# EAGLE design PDB (EAGLE 9.5.0)

## Sheet 1 of 2
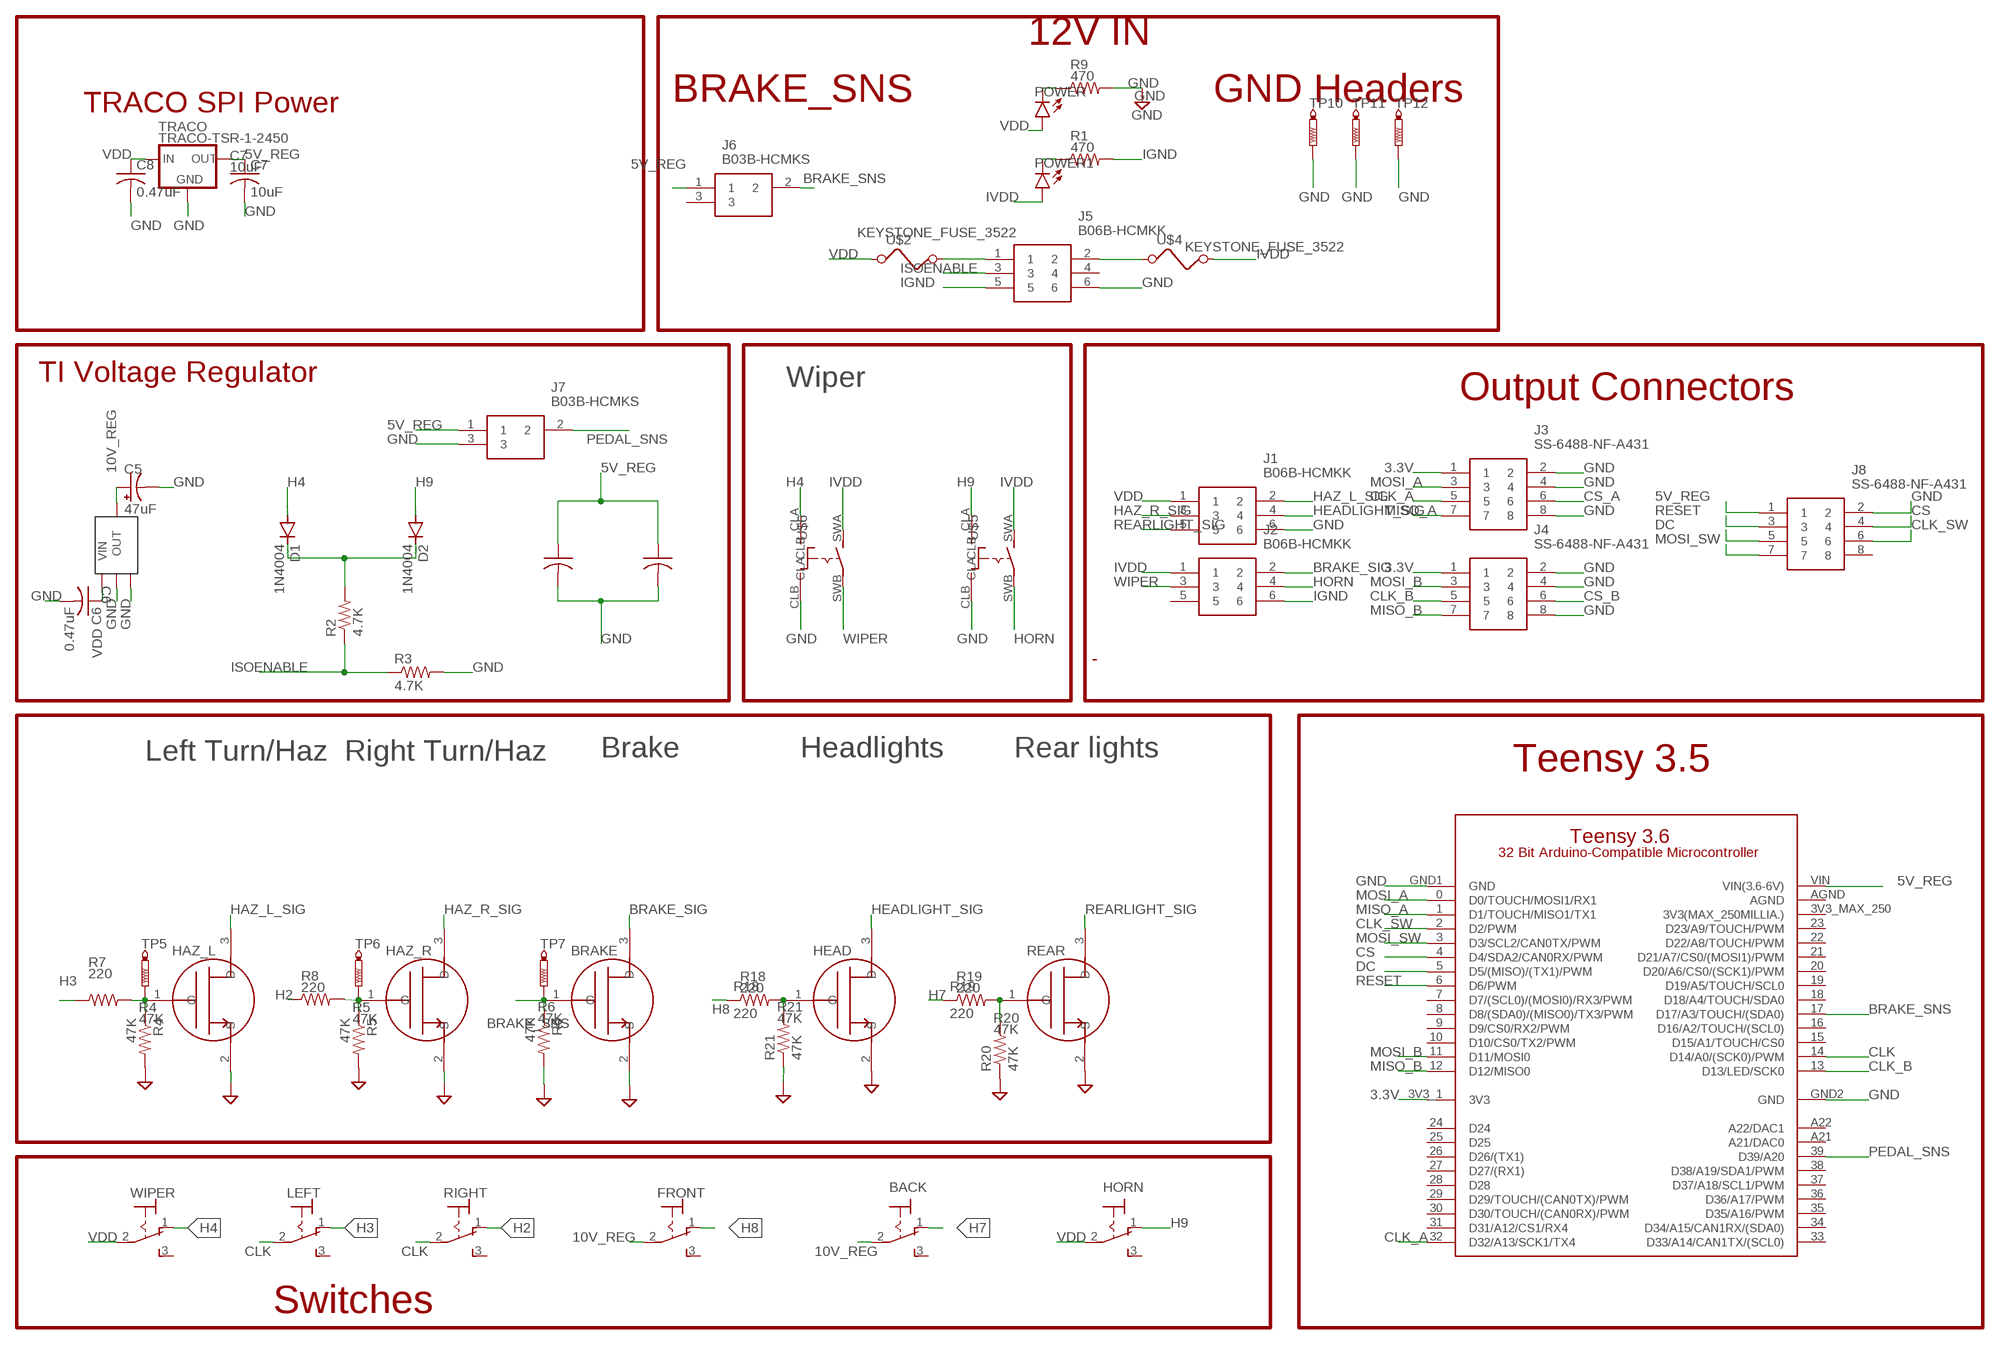
[diagram p0: schematic, sheet 1]

### Parts
BACK  M9040P  [M9040P]
BRAKE  NCV8405ADPAK-3PIN  [TO254P1054X240-3]
C1  0.1uF  C-USC0805  [C0805]
C2  10uF  C-USC0805  [C0805]
C5  47uF  22UF-POLAR-PANASONIC_C-35V-20%  [PANASONIC_C]
C6  0.47uF  C-USC0805  [C0805]
C7  10uF  C-USC0805  [C0805]
C8  0.47uF  C-USC0805  [C0805]
D1  1N4004  [DO41-10]
D2  1N4004  [DO41-10]
FRONT  M9040P  [M9040P]
HAZ_L  NCV8405ADPAK-3PIN  [TO254P1054X240-3]
HAZ_R  NCV8405ADPAK-3PIN  [TO254P1054X240-3]
HEAD  NCV8405ADPAK-3PIN  [TO254P1054X240-3]
HORN  M9040P  [M9040P]
J1  B06B-HCMKK  [B06BHCMKK]
J2  B06B-HCMKK  [B06BHCMKK]
J3  SS-6488-NF-A431  [SS6488NFA431]
J4  SS-6488-NF-A431  [SS6488NFA431]
J5  B06B-HCMKK  [B06BHCMKK]
J6  B03B-HCMKS  [B03BHCMKS]
J7  B03B-HCMKS  [B03BHCMKS]
J8  SS-6488-NF-A431  [SS6488NFA431]
LEFT  M9040P  [M9040P]
LM2940  LM2940LM  [SOT230P700X180-4]
POWER  LEDCHIPLED_0805  [CHIPLED_0805]
POWER1  LEDCHIPLED_0805  [CHIPLED_0805]
R1  470  R-US_R3225  [R3225]
R2  4.7K  R-US_R0805  [R0805]
R3  4.7K  R-US_R0805  [R0805]
R4  47K  R-US_R0805  [R0805]
R5  47K  R-US_R0805  [R0805]
R6  47K  R-US_R0805  [R0805]
R7  220  R-US_R0805  [R0805]
R8  220  R-US_R0805  [R0805]
R9  470  R-US_R3225  [R3225]
R18  220  R-US_R0805  [R0805]
R19  220  R-US_R0805  [R0805]
R20  47K  R-US_R0805  [R0805]
R21  47K  R-US_R0805  [R0805]
REAR  NCV8405ADPAK-3PIN  [TO254P1054X240-3]
RIGHT  M9040P  [M9040P]
TP5  PTR1B2,54  [B2,54]
TP6  PTR1B2,54  [B2,54]
TP7  PTR1B2,54  [B2,54]
TP10  PTR1PAD1-13Y  [P1-13Y]
TP11  PTR1PAD1-13Y  [P1-13Y]
TP12  PTR1PAD1-13Y  [P1-13Y]
TRACO  TRACO-TSR-1-2450  [SIP3]
U$2  KEYSTONE_FUSE_3522  [KEYSTONE_FUSE_3522]
U$3  TEENSY-3.6_ONLY_HOLES  [TEENSY-3.6_ONLY_HOLES]
U$4  KEYSTONE_FUSE_3522  [KEYSTONE_FUSE_3522]
U$5  TE_CON_OJE-SH-112DM,095\  [TE_CON_OJE-SH-112DM,095]
U$6  TE_CON_OJE-SH-112DM,095\  [TE_CON_OJE-SH-112DM,095]
WIPER  M9040P  [M9040P]

### Nets
3.3V: J3.1 J4.1 U$3.3V3_1(3V3)
5V_REG: C1.1 C2.1 C7.1 J6.1 J7.1 J8.1 TRACO.3(OUT) U$3.VIN(VIN(3.6-6V))
10V_REG: BACK.2(P) C5.+ FRONT.2(P) LM2940.3(OUT)
BRAKE_SIG: BRAKE.3(D) J2.2
BRAKE_SNS: BRAKE.1(G) J6.2 R6.1 TP7.TP U$3.17(D17/A3/TOUCH/(SDA0))
CLK: LEFT.2(P) RIGHT.2(P) U$3.14(D14/A0/(SCK0)/PWM)
CLK_A: J3.5 U$3.32(D32/A13/SCK1/TX4)
CLK_B: J4.5 U$3.13(D13/LED/SCK0)
CLK_SW: J8.6 U$3.2(D2/PWM)
CS: J8.4 U$3.4(D4/SDA2/CAN0RX/PWM)
CS_A: J3.6
CS_B: J4.6
DC: J8.5 U$3.5(D5/(MISO)/(TX1)/PWM)
GND: BRAKE.2(S) C1.2 C2.2 C5.- C6.2 C7.2 C8.2 HAZ_L.2(S) HAZ_R.2(S) HEAD.2(S) J1.6 J3.2 J3.4 J3.8 J4.2 J4.4 J4.8 J5.6 J7.3 J8.2 LM2940.2(GND2) LM2940.4(GND) R3.2 R4.2 R5.2 R6.2 R9.2 R20.1 R21.1 REAR.2(S) TP10.TP TP11.TP TP12.TP TRACO.2(GND) U$3.GND1(GND) U$3.GND2(GND) U$5.CLB U$6.CLB
H2: R8.1 RIGHT.1(O)
H3: LEFT.1(O) R7.1
H4: D1.A U$6.CLA WIPER.1(O)
H7: BACK.1(O) R19.1
H8: FRONT.1(O) R18.1
H9: D2.A HORN.1(O) U$5.CLA
HAZ_L_SIG: HAZ_L.3(D) J1.2
HAZ_R_SIG: HAZ_R.3(D) J1.3
HEADLIGHT_SIG: HEAD.3(D) J1.4
HL_GATE: HAZ_L.1(G) R4.1 R7.2 TP5.TP
HORN: J2.4 U$5.SWB
HR_GATE: HAZ_R.1(G) R5.1 R8.2 TP6.TP
IGND: J2.6 J5.5 R1.2
ISOENABLE: J5.3 R2.1 R3.1
IVDD: J2.1 POWER1.A U$4.B1 U$4.B2 U$5.SWA U$6.SWA
MISO_A: J3.7 U$3.1(D1/TOUCH/MISO1/TX1)
MISO_B: J4.7 U$3.12(D12/MISO0)
MOSI_A: J3.3 U$3.0(D0/TOUCH/MOSI1/RX1)
MOSI_B: J4.3 U$3.11(D11/MOSI0)
MOSI_SW: J8.7 U$3.3(D3/SCL2/CAN0TX/PWM)
N$1: POWER.C R9.1
N$3: D1.C D2.C R2.2
N$7: J5.1 U$2.B1 U$2.B2
N$8: J5.2 U$4.A1 U$4.A2
N$10: POWER1.C R1.1
N$14: HEAD.1(G) R18.2 R21.2
N$15: R19.2 R20.2 REAR.1(G)
PEDAL_SNS: J7.2 U$3.39(D39/A20)
REARLIGHT_SIG: J1.5 REAR.3(D)
RESET: J8.3 U$3.6(D6/PWM)
VDD: C6.1 C8.1 HORN.2(P) J1.1 LM2940.1(VIN) POWER.A TRACO.1(IN) U$2.A1 U$2.A2 WIPER.2(P)
WIPER: J2.3 U$6.SWB
Unconnected: BACK.3(S) FRONT.3(S) HORN.3(S) J2.5 J5.4 J6.3 J8.8 LEFT.3(S) RIGHT.3(S) U$3.3V3_MAX_250(3V3(MAX_250MILLIA.)) U$3.7(D7/(SCL0)/(MOSI0)/RX3/PWM) U$3.8(D8/(SDA0)/(MISO0)/TX3/PWM) U$3.9(D9/CS0/RX2/PWM) U$3.10(D10/CS0/TX2/PWM) U$3.15(D15/A1/TOUCH/CS0) U$3.16(D16/A2/TOUCH/(SCL0)) U$3.18(D18/A4/TOUCH/SDA0) U$3.19(D19/A5/TOUCH/SCL0) U$3.20(D20/A6/CS0/(SCK1)/PWM) U$3.21(D21/A7/CS0/(MOSI1)/PWM) U$3.22(D22/A8/TOUCH/PWM) U$3.23(D23/A9/TOUCH/PWM) U$3.24(D24) U$3.25(D25) U$3.26(D26/(TX1)) U$3.27(D27/(RX1)) U$3.28(D28) U$3.29(D29/TOUCH/(CAN0TX)/PWM) U$3.30(D30/TOUCH/(CAN0RX)/PWM) U$3.31(D31/A12/CS1/RX4) U$3.33(D33/A14/CAN1TX/(SCL0)) U$3.34(D34/A15/CAN1RX/(SDA0)) U$3.35(D35/A16/PWM) U$3.36(D36/A17/PWM) U$3.37(D37/A18/SCL1/PWM) U$3.38(D38/A19/SDA1/PWM) U$3.A21(A21/DAC0) U$3.A22(A22/DAC1) WIPER.3(S)

### Notes on the sheet
- 12V IN
- BRAKE_SNS | GND Headers
- TRACO SPI Power
- TI Voltage Regulator | Wiper
- Output Connectors
- Left Turn/Haz | Right Turn/Haz | Brake | Headlights | Rear lights
- Teensy 3.5
- Switches

## Sheet 2 of 2

## Power pins joined to a net without a drawn wire
AGND: U$3.AGND

## Library data of the parts
BACK FRONT HORN LEFT RIGHT WIPER = switch:M9040P: TOGGLE SWITCH Marquardt
BRAKE HAZ_L HAZ_R HEAD REAR = master_library:NCV8405A
C1 C2 C6-C8 = rcl:C-US: CAPACITOR, American symbol; SPICEPREFIX: C
C5 = SparkFun-Capacitors:22UF-POLAR: 22µF polarized capacitors A capacitor is a passive two-terminal electrical component used to store electrical energy temporarily in an electric field.; PROD_ID: CAP-08618; VALUE: 22uF
D1 D2 = diode:1N4004: DIODE general purpose rectifier, 1 A
J1 J2 J5 = AUX Lib:B06B-HCMKK: Automotive Connectors 6P AIT Header Top Position (BLK) Source: Datasheet <https://componentsearchengine.com/Datasheets/1/B06B-HCMKK.pdf>; DESCRIPTION: Automotive Connectors 6P AIT Header Top Position (BLK); HEIGHT: 13.7mm; MANUFACTURER_NAME: JST (JAPAN SOLDERLESS TERMINALS); MANUFACTURER_PART_NUMBER: B06B-HCMKK; MOUSER_PART_NUMBER: 306-B06B-HCMKK; MOUSER_PRICE-STOCK: https://www.mouser.com/Search/Refine.aspx?Keyword=306-B06B-HCMKK
J3 J4 J8 = AUX Lib:SS-6488-NF-A431: Modular Connectors / Ethernet Connectors RJ45 Connector Source: Datasheet <https://www.mouser.pr/datasheet/2/643/dr-STW-SS-6488-NF-A431-1155183.pdf>; DESCRIPTION: Modular Connectors / Ethernet Connectors RJ45 Connector; HEIGHT: 12.82mm; MANUFACTURER_NAME: Bel; MANUFACTURER_PART_NUMBER: SS-6488-NF-A431; MOUSER_PART_NUMBER: 530-SS-6488-NF-A431
J6 J7 = AUX Lib:B03B-HCMKS: Automotive Connectors 3P AIT Header Top Position (Natural) Source: Datasheet <https://componentsearchengine.com/Datasheets/1/B03B-HCMKS.pdf>; DESCRIPTION: Automotive Connectors 3P AIT Header Top Position (Natural); HEIGHT: 13.7mm; MANUFACTURER_NAME: JST (JAPAN SOLDERLESS TERMINALS); MANUFACTURER_PART_NUMBER: B03B-HCMKS; MOUSER_PART_NUMBER: 306-B03B-HCMKS; MOUSER_PRICE-STOCK: https://www.mouser.com/Search/Refine.aspx?Keyword=306-B03B-HCMKS
LM2940 = master_library:LM2940
POWER POWER1 = led:LED: LED OSRAM: - CHIPLED LG R971, LG N971, LY N971, LG Q971, LY Q971, LO R971, LY R971 LH N974, LH R974 LS Q976, LO Q976, LY Q976 LO Q996 - Hyper CHIPLED LW Q18S LB Q993, LB Q99A, LB R99A - SideLED LS A670, LO A670, LY A670, LG A670, LP A670 LB A673, LV A673, LT A673, LW A673 LH A674 LY A675 LS A676, LA A676, LO A676, LY A676, LW A676 LS A679, LY A679, LG A679 - Hyper Micro SIDELED® LS Y876, LA Y876, LO Y876, LY Y876 LT Y87S - SmartLED LW L88C, LW L88S LB L89C, LB L89S, LG L890 LS L89K, LO L89K, LY L89K LS L896, LA L896, LO L896, LY L896 - TOPLED LS T670, LO T670, LY T670, LG T670, LP T670 LSG T670, LSP T670, LSY T670, LOP T670, LYG T670 LG T671, LOG T671, LSG T671 LB T673, LV T673, LT T673, LW T673 LH T674 LS T676, LA T676, LO T676, LY T676, LB T676, LH T676, LSB T676, LW T676 LB T67C, LV T67C, LT T67C, LS T67K, LO T67K, LY T67K, LW E67C LS E67B, LA E67B, LO E67B, LY E67B, LB E67C, LV E67C, LT E67C LW T67C LS T679, LY T679, LG T679 LS T770, LO T770, LY T770, LG T770, LP T770 LB T773, LV T773, LT T773, LW T773 LH T774 LS E675, LA E675, LY E675, LS T675 LS T776, LA T776, LO T776, LY T776, LB T776 LHGB T686 LT T68C, LB T68C - Hyper Mini TOPLED® LB M676 - Mini TOPLED Santana® LG M470 LS M47K, LO M47K, LY M47K Source: http://www.osram.convergy.de LUXEON: - LUMILED® LXK2-PW12-R00, LXK2-PW12-S00, LXK2-PW14-U00, LXK2-PW14-V00 LXK2-PM12-R00, LXK2-PM12-S00, LXK2-PM14-U00 LXK2-PE12-Q00, LXK2-PE12-R00, LXK2-PE12-S00, LXK2-PE14-T00, LXK2-PE14-U00 LXK2-PB12-K00, LXK2-PB12-L00, LXK2-PB12-M00, LXK2-PB14-N00, LXK2-PB14-P00, LXK2-PB14-Q00 LXK2-PR12-L00, LXK2-PR12-M00, LXK2-PR14-Q00, LXK2-PR14-R00 LXK2-PD12-Q00, LXK2-PD12-R00, LXK2-PD12-S00 LXK2-PH12-R00, LXK2-PH12-S00 LXK2-PL12-P00, LXK2-PL12-Q00, LXK2-PL12-R00 Source: www.luxeon.com KINGBRIGHT: KA-3528ASYC Source: www.kingbright.com
R1 R9 = resistor:R-US_: RESISTOR, American symbol
R2 R3 R7 R8 = master_library:R-US_: RESISTOR, American symbol
R4-R6 R18-R21 = rcl:R-US_: RESISTOR, American symbol; SPICEPREFIX: R
TP5-TP7 TP10-TP12 = testpad:PTR1: TEST PIN
TRACO = master_library:TRACO-TSR-1-2450: An all-in-one switching regulator from TRACO
U$2 U$4 = AUX Lib:KEYSTONE_FUSE_3522
U$3 = AUX Lib:TEENSY-3.6_ONLY_HOLES
U$5 U$6 = AUX Lib:TE_CON_OJE-SH-112DM,095\

## Board
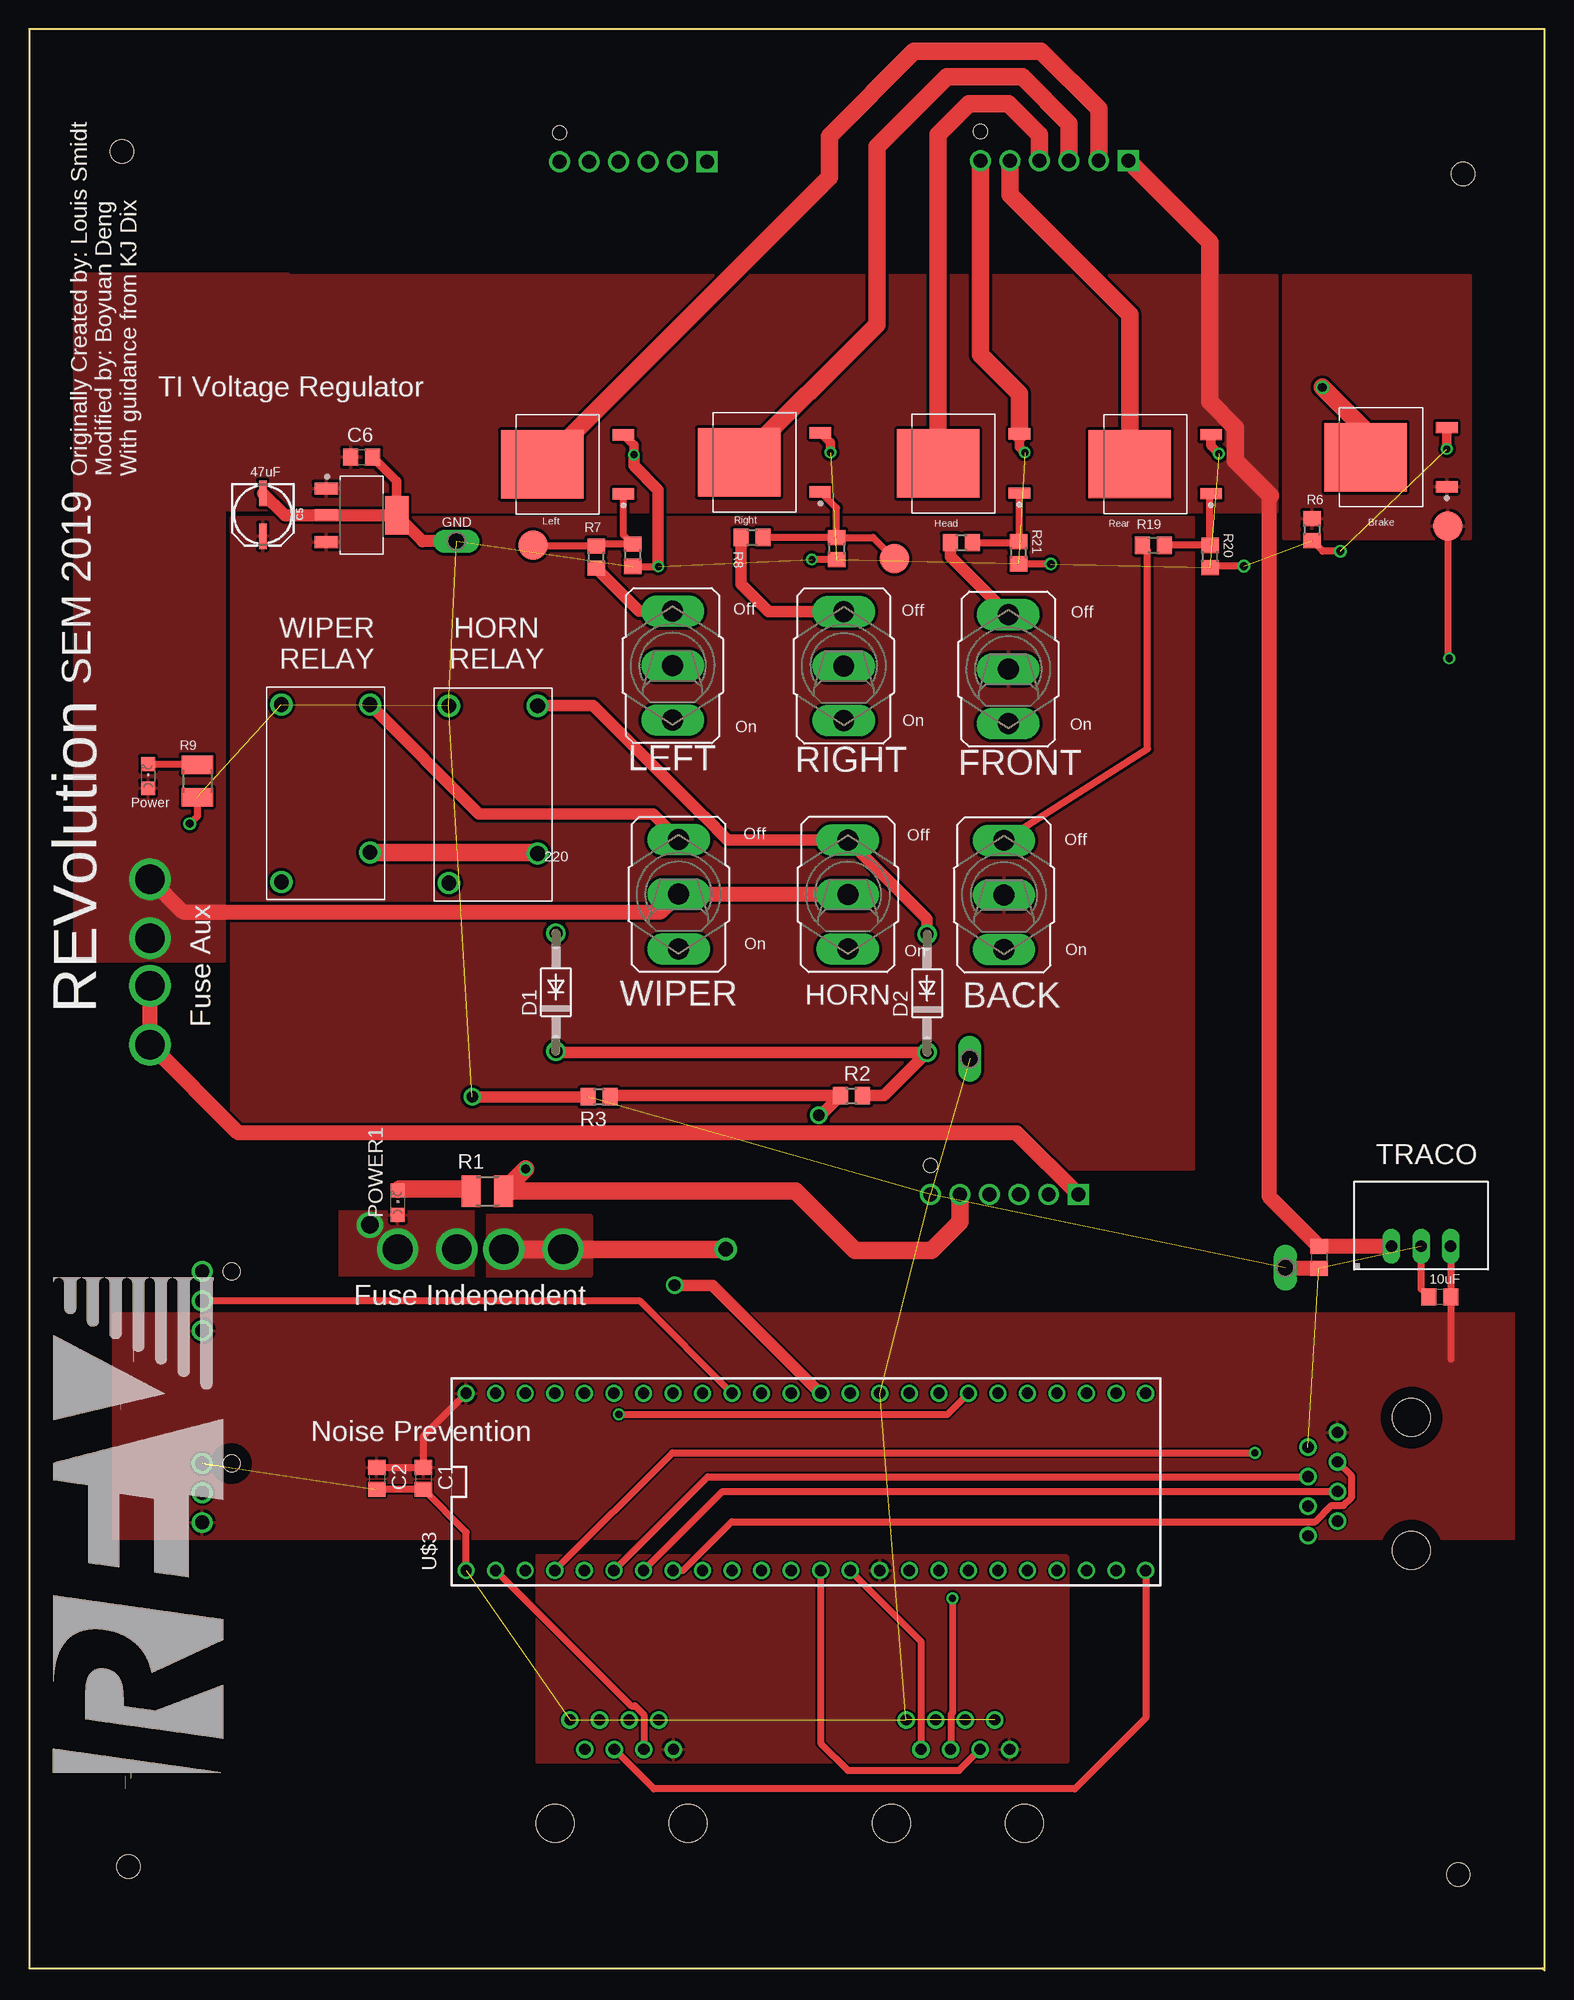
[diagram p1: board, top side]
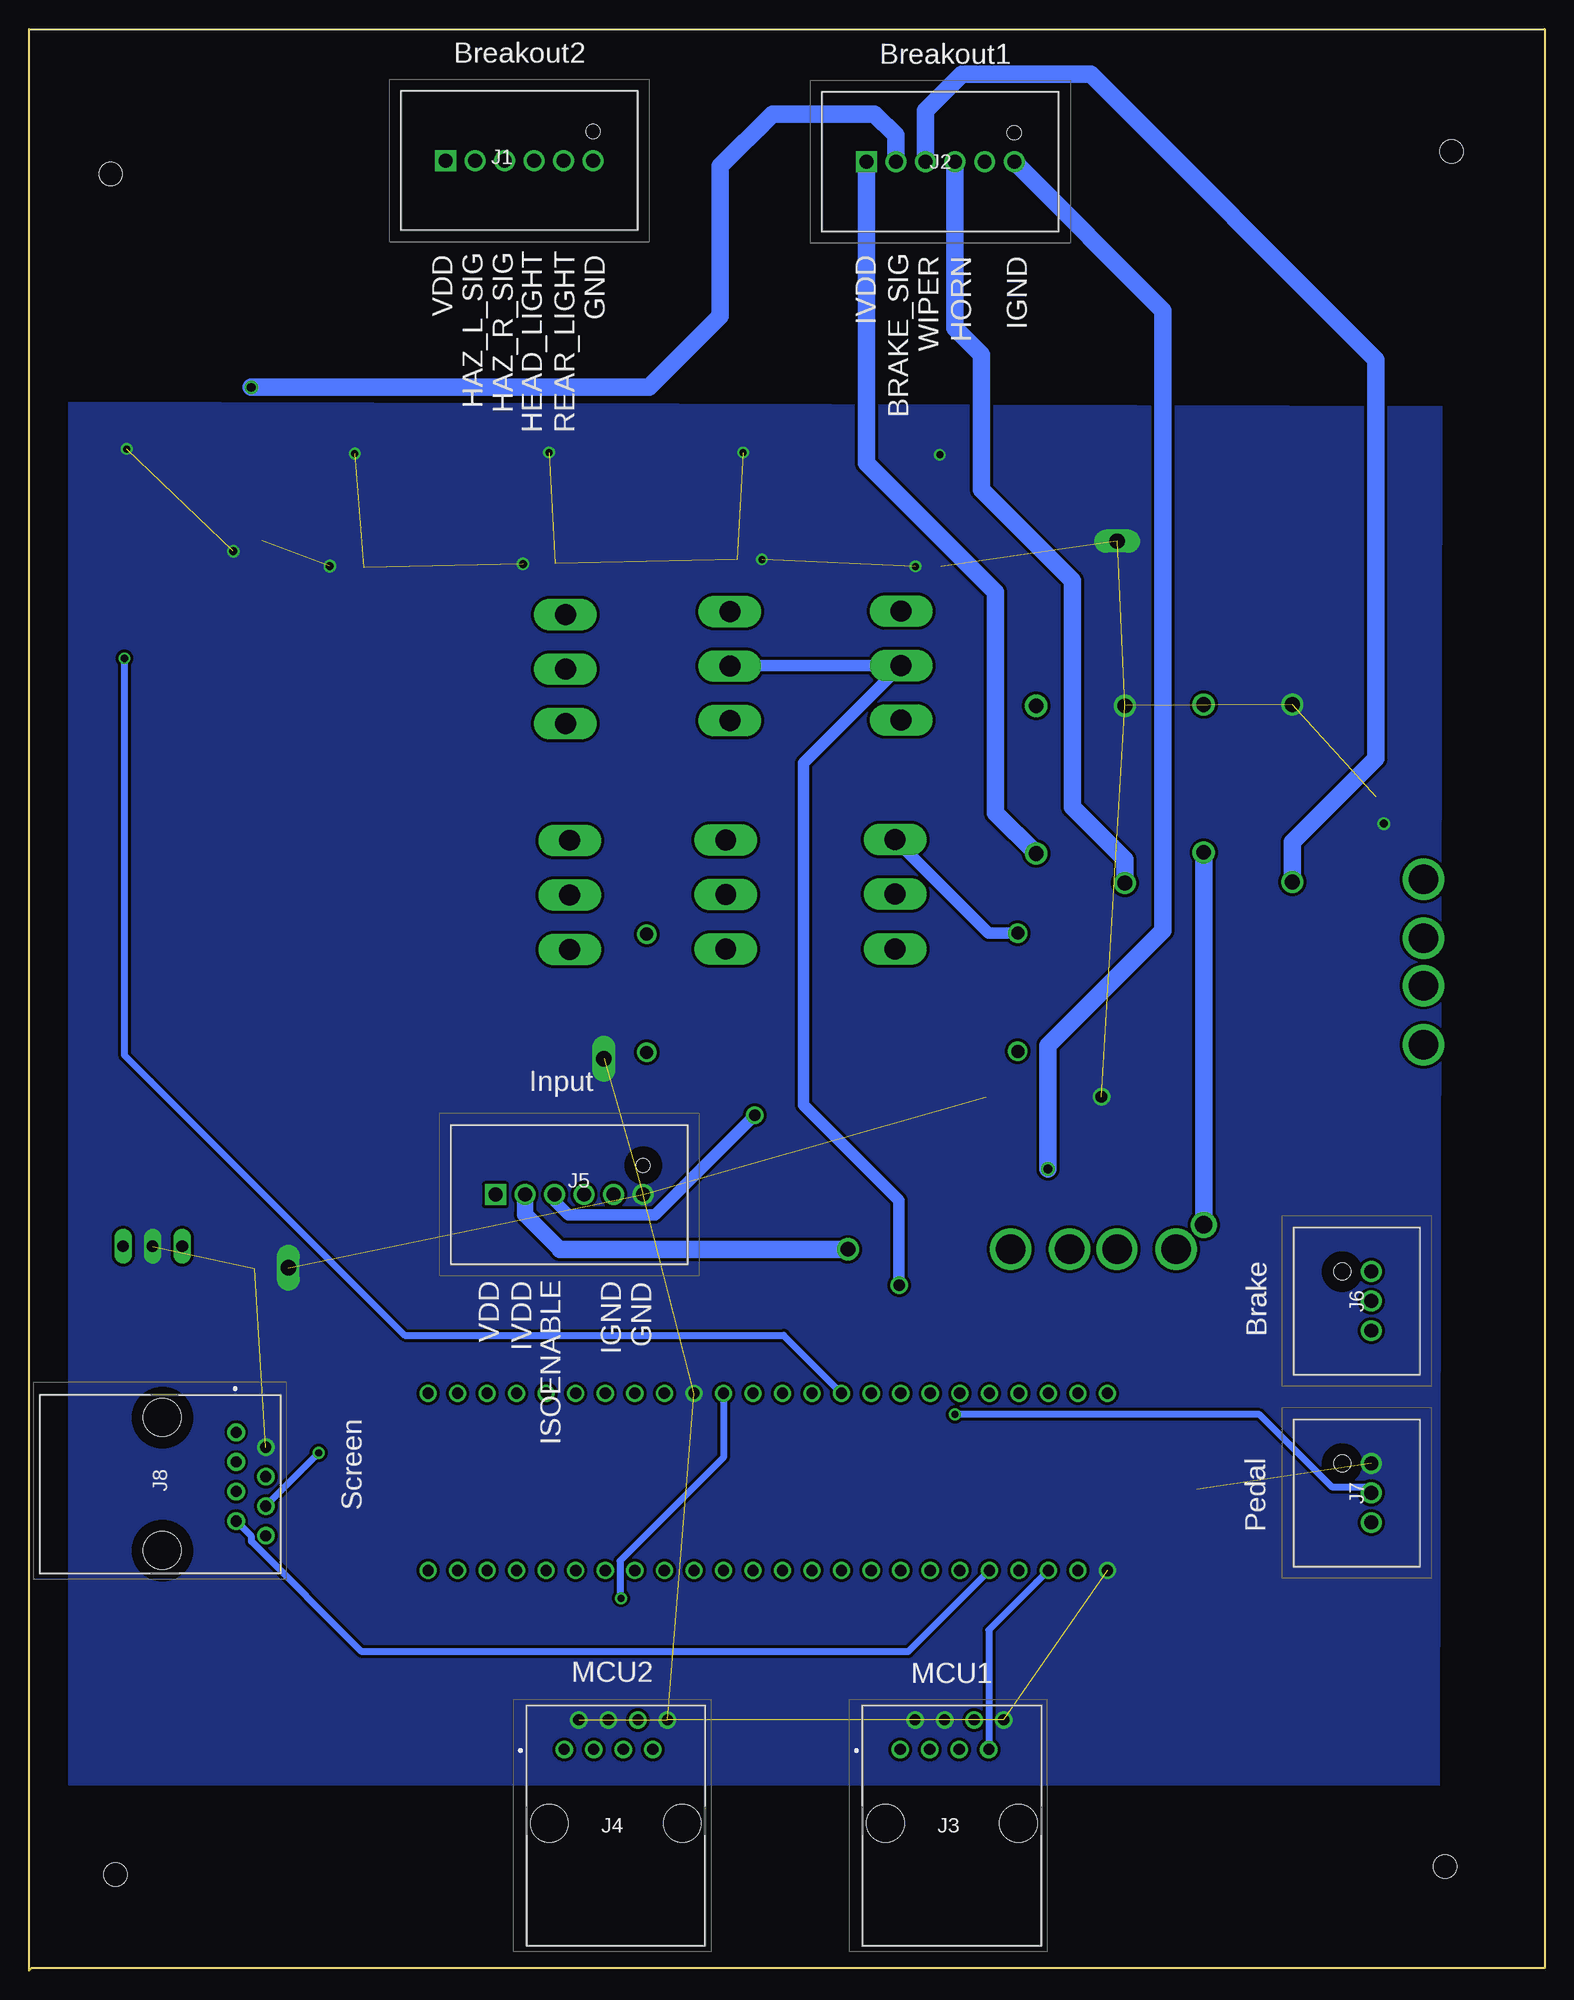
[diagram p2: board, bottom side, seen from below]

Size 130.3 x 166.9 mm. Coordinates in mm from the lower left corner, seen from the top.
Outline: 0,166.9 0,0.2 130.1,0.2 130.3,0 130.3,166.9 0,166.9
Copper layers (1*16): Top 0.035mm / dielectric 1.5mm / Bottom 0.035mm
Design rules "default *": minimum track width 6mil, minimum drill 0.35mm, track to track 6mil, track to pad 6mil, pad to pad 6mil, via to via 6mil, smd to smd 6mil, copper to edge 40mil, drill to drill 6mil, minimum pad ring 10mil, minimum via ring 8mil, stop-mask expansion 4mil, vias tented up to drill 0mil, thermal gap 10mil
Holes 2 mm at 8,156.36 8.56,8.92 123.28,154.44 122.88,8.26

### Footprints (pad centres in the part's own frame; a part is rotated, then mirrored left to right if it is on the bottom)
M9040P = drill 1.803 long: 1 0,4.699; 2 0,0; 3 0,-4.699
TO254P1054X240-3 = smd 1.858 x 0.965: 1 -4.798,2.54; 2 -4.798,-2.54 | smd 7.083 x 5.874: 3 2.185,0
C0805 = smd 1.3 x 1.5: 1 -0.95,0; 2 0.95,0
PANASONIC_C = smd 2.2 x 0.65: + 1.9,-0.2; - -1.8,-0.2
DO41-10 = drill 1.118: A 5.08,0; C -5.08,0
B06BHCMKK = drill 1.2 pad 1.8 square: 1 0,0 | drill 1.2 pad 1.8: 2 2.54,0; 3 5.08,0; 4 7.62,0; 5 10.16,0; 6 12.7,0 | hole 1.2: 12.7,2.5
SS6488NFA431 = drill 0.97 pad 1.509: 1 0,0; 2 1.27,2.54; 3 2.54,0; 4 3.81,2.54; 5 5.08,0; 6 6.35,2.54; 7 7.62,0; 8 8.89,2.54 | hole 3.25: -1.27,-6.35; 10.16,-6.35
B03BHCMKS = drill 1.2 pad 1.8: 1 0,0; 2 2.54,0; 3 5.08,0 | hole 1.45: 5.08,2.5
SOT230P700X180-4 = smd 2.025 x 1.034: 1 -3.027,2.3; 2 -3.027,0; 3 -3.027,-2.3 | smd 2.025 x 3.334: 4 3.027,0
CHIPLED_0805 = smd 1.2 x 1.2: A 0,-1.05; C 0,1.05
R3225 = smd 1.6 x 2.7: 1 -1.4,0; 2 1.4,0
R0805 = smd 1.3 x 1.5: 1 -0.95,0; 2 0.95,0
B2,54 = smd 2.54 x 2.54: TP 0,0
P1-13Y = drill 1.321 pad 1.905 long: TP 0,0
SIP3 = drill 1 long: 1 -2.54,0; 2 0,0; 3 2.54,0
KEYSTONE_FUSE_3522 = drill 2.54: A1 -7.112,0; A2 -2.032,0; B1 2.032,0; B2 7.112,0
TEENSY-3.6_ONLY_HOLES = drill 0.965: 0 -7.62,5.08; 1 -7.62,2.54; 2 -7.62,0; 3 -7.62,-2.54; 3V3_1 -7.62,-27.94; 3V3_MAX_250 7.62,2.54; 4 -7.62,-5.08; 5 -7.62,-7.62; 6 -7.62,-10.16; 7 -7.62,-12.7; 8 -7.62,-15.24; 9 -7.62,-17.78; 10 -7.62,-20.32; 11 -7.62,-22.86; 12 -7.62,-25.4; 13 7.62,-25.4; 14 7.62,-22.86; 15 7.62,-20.32; 16 7.62,-17.78; 17 7.62,-15.24; 18 7.62,-12.7; 19 7.62,-10.16; 20 7.62,-7.62; 21 7.62,-5.08; 22 7.62,-2.54; 23 7.62,0; 24 -7.62,-30.48; 25 -7.62,-33.02; 26 -7.62,-35.56; 27 -7.62,-38.1; 28 -7.62,-40.64; 29 -7.62,-43.18; 30 -7.62,-45.72; 31 -7.62,-48.26; 32 -7.62,-50.8; 33 7.62,-50.8; 34 7.62,-48.26; 35 7.62,-45.72; 36 7.62,-43.18; 37 7.62,-40.64; 38 7.62,-38.1; 39 7.62,-35.56; A21 7.62,-33.02; A22 7.62,-30.48; AGND 7.62,5.08; GND1 -7.62,7.62; GND2 7.62,-27.94; VIN 7.62,7.62
TE_CON_OJE-SH-112DM,095 = drill 1.27: CLA -7.62,3.81; CLB -7.62,-3.81; SWA 5.08,3.81; SWB 7.62,-3.81

### Placement (x,y rotation side)
BACK  83.81,92.46 0 top
BRAKE  117.09,130.09 180 top
C1  33.9,42.3 270 top
C2  29.9,42.3 270 top
C5  20.3,125.2 270 top
C6  28.6,130.1 0 top
C7  121.3,57.9 180 top
C8  110.9,61.3 270 top
D1  45.3,84.1 90 top
D2  77.2,84 90 top
FRONT  84.19,111.88 0 top
HAZ_L  46.3,129.47 180 top
HAZ_R  63.24,129.65 180 top
HEAD  80.35,129.55 180 top
HORN  70.4,92.5 0 top
J1  94.5,155.6 0 bottom
J2  58.3,155.5 0 bottom
J3  55.4,19 0 bottom
J4  84.3,19 0 bottom
J5  90.2,66.7 0 bottom
J6  14.9,55 90 bottom
J7  14.9,38.5 90 bottom
J8  112.5,46.26 270 bottom
LEFT  55.33,112.18 0 top
LM2940  28.58,125.1 0 top
POWER  10.24,102.68 0 top
POWER1  31.7,66 0 top
R1  39.4,67 0 top
R2  70.7,75.2 0 top
R3  49,75.1 180 top
R4  51.89,121.66 270 top
R5  69.43,122.24 270 top
R6  110.29,123.87 270 top
R7  48.76,121.5 90 top
R8  62.16,123.2 0 top
R9  14.46,102.26 270 top
R18  80.17,122.75 0 top
R19  96.66,122.53 0 top
R20  101.53,121.56 90 top
R21  85.07,121.88 90 top
REAR  96.82,129.49 180 top
RIGHT  70.04,112.14 0 top
TP5  43.33,122.55 0 top
TP6  74.38,121.37 0 top
TP7  121.98,124.15 0 top
TP10  36.75,122.88 270 top
TP11  80.88,78.39 0 top
TP12  108.01,60.4 0 top
TRACO  119.68,62.26 0 top
U$2  10.4,86.7 270 top
U$3  45.2,42 90 top
U$4  38.8,62 180 top
U$5  39.9,101.1 270 top
U$6  25.5,101.2 270 top
WIPER  55.85,92.52 0 top

### Tracks (layer width: path | path; a pad name or v marks a point on that pad's centre or on a via)
3.3V
  pour Top: 43.6,35.5 43.6,17.9 89.3,17.9 89.4,18 89.4,35.5 89.2,35.7 43.6,35.7
5V_REG
  Top 0.61: TRACO.3 122.22,57.93 C7.1 122.25,52.55 | U$3.VIN 33.9,45.94 C1.1 C2.1
  pour Top: 7.2,56.5 7.2,37.1 127.7,37.1 127.7,56.5
10V_REG
  pour Top (isolate 0.254): 17.4,68.9 17.4,124.9 100.1,124.9 100.1,68.9
BRAKE_SIG  (via drill 0.76)
  Top 1.524: BRAKE.3 114.91,132.39 v111.2,136.1
  Bottom 1.524: J2.2 55.76,157.76 57.6,159.6 66.4,159.6 70.9,155.1 70.9,142.2 77,136.1 v111.2,136.1
BRAKE_SNS  (via drill 0.61)
  Top 0.61: U$3.17 52.52,57.54 J6.2 | TP7.TP 121.98,112.92 v122.1,112.8
  Bottom 0.61: U$3.17 65.42,54.6 98,54.6 122.1,78.7 v122.1,112.8
  pour Top (isolate 0.254): 107.9,145.7 107.9,123.1 123.9,123.1 123.9,145.7
CLK  (via drill 1)
  Top 1: U$3.14 58.78,58.9 v55.5,58.9
  Bottom 1: v55.5,58.9 55.5,66.2 63.7,74.4 63.7,103.81 LEFT.2 70,112.18 RIGHT.2
CLK_A
  Top 0.61: U$3.32 96,21.7 89.9,15.6 53.72,15.6 J3.5
CLK_B  (via drill 0.61)
  Top 0.61: v79.4,32 79.4,22.16 79.28,22.04 79.28,19.06 J4.5
  Bottom 0.61: U$3.13 70.6,44.1 79.5,35.2 79.5,32.1 v79.4,32
CLK_SW  (via drill 0.61)
  Top 0.61: U$3.2 55.32,44.5 v105.4,44.5
  Bottom 0.61: v105.4,44.5 109.95,39.95 J8.6
CS
  Top 0.61: U$3.4 58.35,42.45 J8.4
DC
  Top 0.61: U$3.5 59.62,41.18 J8.5
GND  (via drill 0.6, 0.69, 1)  (27 unrouted)
  Top 0.61: v13.82,98.58 14.46,99.22 R9.2 | v104.44,120.72 101.77,120.72 R20.1 | v87.84,120.92 R21.1 | R6.2 111.21,122 v112.74,122 | R5.2 67.31,121.29 | R4.2 v54.09,120.71 | U$3.GND1 37.58,37.67 C1.2 C2.2 | C7.2 119.68,58.57 TRACO.2
  Top 0.813: 67.31,121.29 v67.3,121.3 | v54.09,120.71 v54.1,120.7 | v102.3,130.4 101.62,131.08 REAR.2 | v85.6,130.5 85.14,130.96 HEAD.2 | HAZ_R.2 68.9,131.33 v68.9,130.5 | HAZ_L.2 52,131.11 v52,130.3 | BRAKE.2 v121.89,130.81 v121.9,130.8 | C6.2 31.61,128.04 LM2940.4
  Top 1: v52,130.3 52,129.37 54.09,127.27 v54.09,120.71 | R3.2 v38.1,75.1
  Top 1.016: TP10.TP 33.83,122.88 LM2940.4 LM2940.2 22,125.1 C5.-
  Top 1.27: C8.2 108.07,60.35 TP12.TP
  Top 1.524: J1.6 81.8,138.9 85.14,135.56 HEAD.2
  pour Bottom (isolate 0.254, rank 2, no thermals): 9.05,15.97 8.83,134.4 126.91,134.78 126.91,16
H2
  Top 1: RIGHT.1 63.56,116.84 61.2,119.2 R8.1
H3
  Top 1: LEFT.1 52.43,116.88 R7.1
H4
  Top 1: WIPER.1 53.64,99.42 38.7,99.42 U$6.CLA
  Bottom 1: WIPER.1 47.81,89.18 D1.A
H7
  Top 0.61: R19.1 96.16,122.08 96.16,105.02 BACK.1
H8
  Top 1: FRONT.1 79.22,121.55 R18.1
H9
  Top 1: U$5.CLA 48.48,108.72 57.98,99.22 58.03,99.22 60.05,97.2 HORN.1 77.2,90.4 D2.A
HAZ_L_SIG
  Top 1.524: HAZ_L.3 68.8,154.16 68.8,157.7 76.1,165 87,165 91.96,160.04 J1.2
HAZ_R_SIG
  Top 1.524: HAZ_R.3 72.9,141.5 72.9,156.8 78.9,162.8 85.4,162.8 89.42,158.78 J1.3
HEADLIGHT_SIG
  Top 1.524: HEAD.3 78.16,157.82 80.81,160.48 84.22,160.48 86.88,157.82 J1.4
HL_GATE
  Top 0.61: HAZ_L.1 51.1,123.4 R4.1 48.92,122.61 R7.2 43.43,122.45 TP5.TP
HORN
  Bottom 1.524: U$5.SWB 36.09,95.49 40.6,100 40.6,119.5 48.4,127.3 48.4,138.9 50.68,141.18 J2.4
HR_GATE
  Top 0.61: R5.1 69.43,125.72 HAZ_R.1 | R5.1 72.57,123.19 TP6.TP | R5.1 63.12,123.19 R8.2
IGND  (via drill 0.76)
  Top 1.524: J5.5 80.04,64.34 77.6,61.9 71,61.9 65.9,67 R1.2 v42.7,68.9
  Bottom 1.524: v42.7,68.9 42.7,79.5 32.8,89.4 32.8,142.7 J2.6
ISOENABLE  (via drill 1)
  Top 1: R3.1 50.05,75.2 R2.1 68.09,73.54 v67.9,73.54
  Bottom 1: J5.3 85.12,66.14 83.92,64.95 76.49,64.95 v67.9,73.54
IVDD  (via drill 1.5)
  Top 1.5: U$6.SWA 43.61,96.12 U$5.SWA
  Bottom 1.5: U$6.SWA v29.31,64.11 v29.3,64.1
  Bottom 1.524: U$5.SWA 47.2,99.51 47.2,118.5 58.3,129.6 J2.1
  pour Top: 26.6,65.3 26.6,59.7 38.3,59.7 38.3,65.3
MISO_A
  Bottom 0.61: U$3.1 47.78,29.26 J3.7
MISO_B
  Top 0.61: U$3.12 76.68,28.3 J4.7
MOSI_A
  Top 0.61: U$3.0 51.75,22.75 52.09,22.75 52.86,21.98 J3.3
MOSI_B
  Top 0.61: U$3.11 68.06,19.54 70.4,17.2 79.96,17.2 J4.3
MOSI_SW
  Bottom 0.61: U$3.3 54.72,27.4 101.7,27.4 111.17,36.87 111.17,37.31 J8.7
N$1
  Top 0.61: POWER.C 14.39,103.73 R9.1
N$3
  Top 1: D1.C 45.4,78.92 D2.C 73.48,75.2 R2.2
N$7
  Top 1.27: U$2.B1 U$2.B2 17.99,72 84.9,72 J5.1
N$8  (via drill 1.27)
  Top 1.5: v59.9,62 U$4.A1 U$4.A2
  Bottom 1.4: J5.2 87.66,65 84.66,62
  Bottom 1.5: 84.66,62 v59.9,62
  pour Top: 39.3,65 39.3,59.6 48.3,59.6 48.5,59.8 48.5,64.8 48.3,65
N$10
  Top 1.27: R1.1 37.8,67.2 | POWER1.C 31.85,67.2
  Top 1.5: 37.8,67.2 31.85,67.2
N$14
  Top 0.61: R18.2 85,122.75 R21.2 85.14,122.9 HEAD.1
N$15
  Top 0.61: R19.2 101.53,122.53 R20.2 101.53,126.87 REAR.1
PEDAL_SNS  (via drill 0.61)
  Top 0.61: v50.7,47.8 78.94,47.8 U$3.39
  Bottom 0.61: J7.2 15.39,41.53 18.25,41.53 24.51,47.8 v50.7,47.8
REARLIGHT_SIG
  Top 1.524: J1.5 84.34,152.66 94.63,142.37 REAR.3
RESET
  Top 0.61: U$3.6 56.21,34.38 60.41,38.58 110.58,38.58 111.96,39.97 113,39.97 113.71,40.67 113.71,42.51 J8.3
VDD
  Top 1.27: U$2.A1 13.21,91 54.33,91 WIPER.2 70.38,92.52 HORN.2 70.9,92.5 | TRACO.1 C8.1 106.6,66.55 106.6,126.3
  Top 1.524: J1.1 101.5,148.6 101.5,134.85 103.72,132.64 103.72,129.78 106.7,126.8
  pour Top (isolate 0.254): 19.7,142.7 19.7,125.4 107.3,125.4 107.3,145.7 19.5,145.7 19.5,142.9
  pour Top (isolate 0.254): 3.9,90.3 3.9,145.9 22.3,145.9 22.3,125.5 16.8,125.5 16.8,86.7 3.9,86.7
WIPER
  Bottom 1.524: U$6.SWB 21.69,97.01 14.5,104.2 14.5,138.5 39,163 50.1,163 53.22,159.88 J2.3

### Text on the board
tNames: TI Voltage Regulator | Originally Created by: Louis Smidt / Modified by: Boyuan Deng / With guidance from KJ Dix | 47uF | GND | Left | Right | Head | Rear | Brake | Off | Off | Off | WIPER / RELAY | HORN / RELAY | SEM 2019 | On | On | On | Power | Off | Off | Off | 220 | On | On | On | REVolution | Fuse Aux | TRACO | 10uF | Fuse Independent | Noise Prevention
bNames: Breakout1 | Breakout2 | GND | VDD | IGND | IVDD | HORN | WIPER | HAZ_R_SIG | HAZ_L_SIG | BRAKE_SIG | REAR_LIGHT | HEAD_LIGHT | Input | Brake | VDD | GND | IGND | IVDD | ISOENABLE | Screen | Pedal | MCU1 | MCU2